# Altium schematic sheet prg-flash.SchDoc
size A
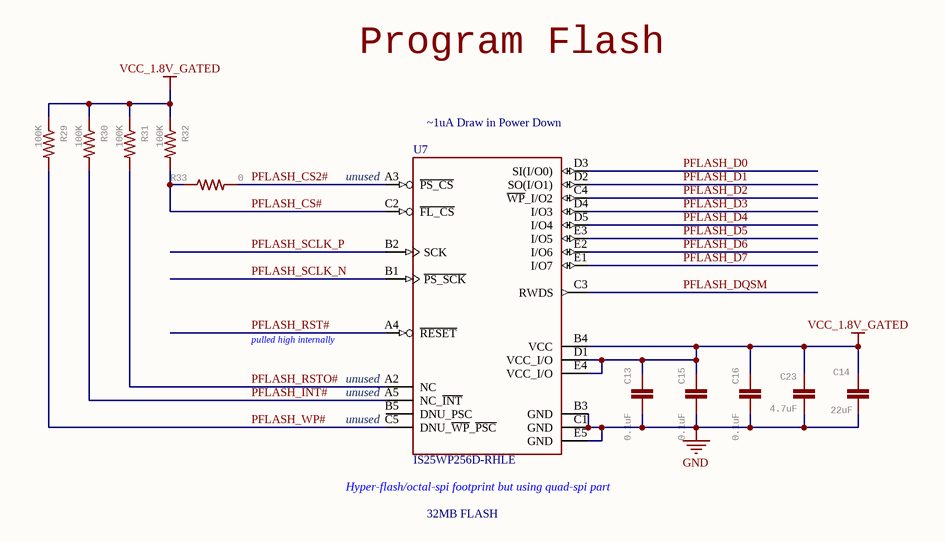
[diagram p0: prg-flash.SchDoc]

## Parts
C13  0.1uF  [0402-CAP]
C14  22uF  [0805]
C15  0.1uF  [0402-CAP]
C16  0.1uF  [0402-CAP]
C23  4.7uF  [0402-CAP]
R29  100K  [0402-RES]
R30  100K  [0402-RES]
R31  100K  [0402-RES]
R32  100K  [0402-RES]
R33  0  [0402-RES]
U7  IS25WP256D-RHLE  [24-TBGA]

## Nets
GND: C13.2 C14.1 C15.2 C16.2 C23.1 U7.B3(GND) U7.C1(GND) U7.E5(GND)
VCC_1.8V_GATED: C13.1 C14.2 C15.1 C16.1 C23.2 R29.1 R30.1 R31.1 R32.1 U7.B4(VCC) U7.D1(VCC_I/O) U7.E4(VCC_I/O)
PFLASH_CS2#: R33.2 U7.A3(~{PS_CS})
PFLASH_CS#: R32.2 R33.1 U7.C2(~{FL_CS})
PFLASH_D0: U7.D3(SI(I/O0))
PFLASH_D1: U7.D2(SO(I/O1))
PFLASH_D2: U7.C4(~{WP}_I/O2)
PFLASH_D3: U7.D4(I/O3)
PFLASH_D4: U7.D5(I/O4)
PFLASH_D5: U7.E3(I/O5)
PFLASH_D6: U7.E2(I/O6)
PFLASH_D7: U7.E1(I/O7)
PFLASH_DQSM: U7.C3(RWDS)
PFLASH_INT#: R30.2 U7.A5(NC_~{INT})
PFLASH_RST#: U7.A4(~{RESET})
PFLASH_RSTO#: R31.2 U7.A2(NC)
PFLASH_SCLK_N: U7.B1(~{PS_SCK})
PFLASH_SCLK_P: U7.B2(SCK)
PFLASH_WP#: R29.2 U7.C5(DNU_~{WP}_~{PSC})

Not connected (* = marked no-connect by the designer): U7 B5(DNU_PSC)

## Notes on the sheet
- Program Flash
- (near U7) ~1uA Draw in Power Down
- (near U7) unused
- pulled high internally
- (near U7) Hyper-flash/octal-spi footprint but using quad-spi part
- 32MB FLASH

## Library data of the parts
C13 C15 C16 = C-EUC0201: CAPACITOR, European symbol; MPN: C0402C104Z4VAC; GateName_1: G$1; SymbolName_1: C-EU; POPULARITY: 0; LibraryName: rcl; DeviceSetName: C-EU; SPICEPREFIX: C; Part Number: C0402C104Z4VAC
C14 = 22UF-0805-6.3V-20%: 22ÂµF ceramic capacitors    A capacitor is a passive two-terminal electrical component used to store electrical energy temporarily in an electric field.; MPN: CL21A226MQQNNNE; GateName_1: G$1; SymbolName_1: CAP; PROD_ID: CAP-08402; DeviceName: -0805-6.3V-20%; LibraryName: SparkFun-Capacitors; DeviceSetName: 22UF; Part Number: CL21A226MQQNNNE
C23 = CAP0402-CAP: CapacitorStandard 0603 ceramic capacitor, and 0.1" leaded capacitor.; MPN: JMK105BBJ475MV-F; GateName_1: G$1; SymbolName_1: CAP; DeviceName: 0402-CAP; LibraryName: sfe; DeviceSetName: CAP; Part Number: JMK105BBJ475MV-F
R29-R32 = RESISTOR0402-RES: ResistorBasic schematic elements and footprints for 0603, 1206, and PTH resistors.; MPN: AC0402FR-07100KL; GateName_1: G$1; SymbolName_1: RESISTOR; DeviceName: 0402-RES; LibraryName: sfe; DeviceSetName: RESISTOR; Part Number: AC0402FR-07100KL
R33 = RESISTOR0402-RES: ResistorBasic schematic elements and footprints for 0603, 1206, and PTH resistors.; MPN: RC0402JR-070R; GateName_1: G$1; SymbolName_1: RESISTOR; DeviceName: 0402-RES; LibraryName: sfe; DeviceSetName: RESISTOR; Part Number: RC0402JR-070R
U7 = IS25WX256-JHLE: IC, Flash,32MB x 8, Octal SPI, Ind Temp, 1.8V,24-BGA; MF: ISSI; Part Number: IS25WP256D-RHLE; MPN: IS25WP256D-RHLE